# EAGLE schematic Schematic (EAGLE 9.1.3)
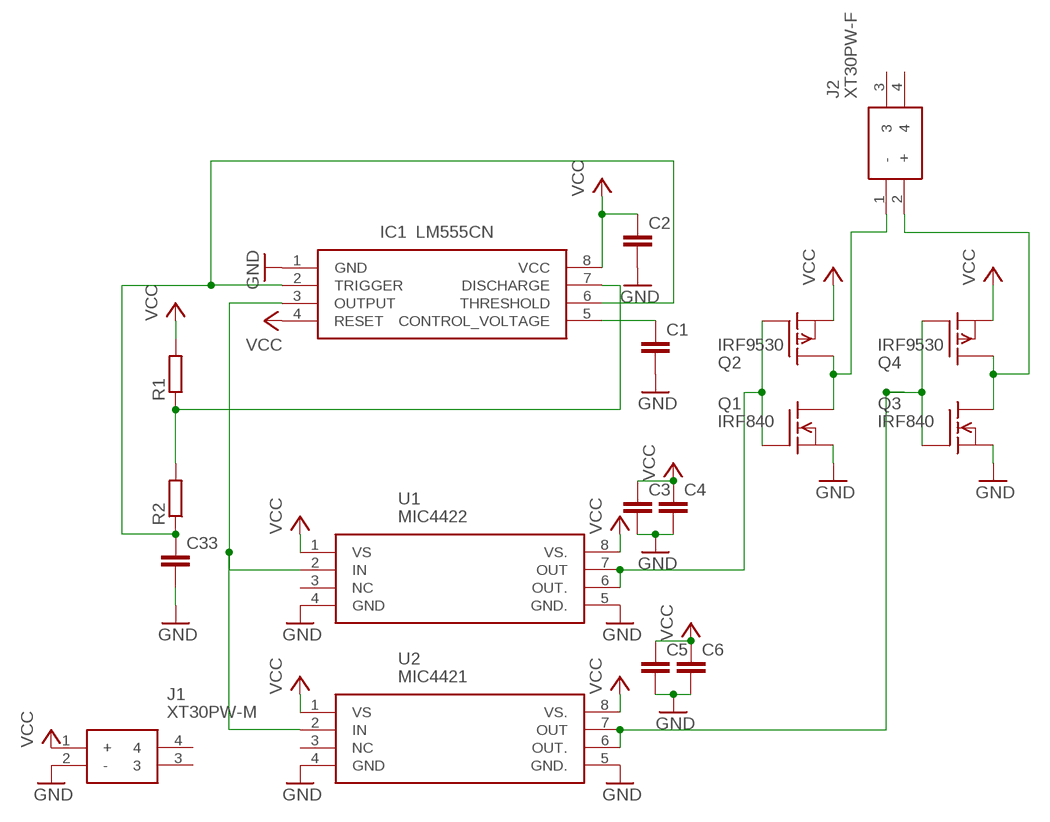
[diagram p0: schematic, sheet 1]

## Parts
C1  C-EU025-050X050  [C025-050X050]
C2  C-EUC0805  [C0805]
C3  C-EUC0805  [C0805]
C4  C-EUC0805  [C0805]
C5  C-EUC0805  [C0805]
C6  C-EUC0805  [C0805]
C33  C-EUC0805  [C0805]
IC1  LM555CN  [DIP762W53P254L980H533Q8N]
J1  XT30PW-M  [XT30PWM]
J2  XT30PW-F  [XT30PWF]
Q1  IRF840  [TO220]
Q2  IRF9530  [TO220]
Q3  IRF840  [TO220]
Q4  IRF9530  [TO220]
R1  R-EU_M0805  [M0805]
R2  R-EU_M0805  [M0805]
U1  MIC4422  MIC4421!  [MIC4421]
U2  MIC4421  MIC4421!  [MIC4421]

## Nets
GND: C1.2 C2.2 C3.2 C4.2 C5.2 C6.2 C33.2 IC1.1(GND) J1.2(-) Q1.3(S) Q3.3(S) U1.4(GND) U1.5(GND.) U2.4(GND) U2.5(GND.)
N$1: C33.1 IC1.2(TRIGGER) IC1.6(THRESHOLD) R2.1
N$2: IC1.7(DISCHARGE) R1.1 R2.2
N$3: C1.1 IC1.5(CONTROL_VOLTAGE)
N$4: J2.1(-) Q1.2(D) Q2.2(D)
N$5: J2.2(+) Q3.2(D) Q4.2(D)
N$8: IC1.3(OUTPUT) U1.2(IN) U2.2(IN)
N$9: Q1.1(G) Q2.1(G) U1.6(OUT.) U1.7(OUT)
N$10: Q3.1(G) Q4.1(G) U2.6(OUT.) U2.7(OUT)
VCC: C2.1 C3.1 C4.1 C5.1 C6.1 IC1.4(RESET) IC1.8(VCC) J1.1(+) Q2.3(S) Q4.3(S) R1.2 U1.1(VS) U1.8(VS.) U2.1(VS) U2.8(VS.)
Unconnected: J1.3 J1.4 J2.3 J2.4 U1.3(NC) U2.3(NC)

## Library data of the parts
C1-C6 C33 = rcl:C-EU: CAPACITOR, European symbol; SPICEPREFIX: C
IC1 = LM555CN:LM555CN: ON Semiconductor LM555CN, Timer, 4.5 16 V, 8-Pin PDIP Source: Datasheet <http://www.onsemi.com/pub/Collateral/LM555-D.pdf>; ARROW_PART_NUMBER: LM555CN; ARROW_PRICE-STOCK: https://www.arrow.com/en/products/lm555cn/on-semiconductor; DESCRIPTION: ON Semiconductor LM555CN, Timer, 4.5 16 V, 8-Pin PDIP; HEIGHT: 5.33mm; MANUFACTURER_NAME: ON Semiconductor; MANUFACTURER_PART_NUMBER: LM555CN; MOUSER_PART_NUMBER: 512-LM555CN; MOUSER_PRICE-STOCK: https://www.mouser.co.uk/ProductDetail/ON-Semiconductor-Fairchild/LM555CN?qs=AFLC8Sm4xaX0SxPz974UPA%3D%3D
J1 = XT30PW-M:XT30PW-M: 30A Low Temperature Rise Fire Retardant Plug Source: Datasheet <https://www.tme.eu/sl/Document/ce4077e36b79046da520ca73227e15de/XT30PW SPEC.pdf>; ARROW_PART_NUMBER: XT30PW-M; DESCRIPTION: 30A Low Temperature Rise Fire Retardant Plug; HEIGHT: 5mm; MANUFACTURER_NAME: Amass; MANUFACTURER_PART_NUMBER: XT30PW-M
J2 = XT30PW-F:XT30PW-F: Socket; DC supply; XT30; female; PIN:2; on PCBs; THT; Colour: yellow Source: Datasheet <https://www.tme.eu/Document/ce4077e36b79046da520ca73227e15de/XT30PW SPEC.pdf>; ARROW_PART_NUMBER: XT30PW-F; DESCRIPTION: Socket; DC supply; XT30; female; PIN:2; on PCBs; THT; Colour: yellow; HEIGHT: 5mm; MANUFACTURER_NAME: Amass; MANUFACTURER_PART_NUMBER: XT30PW-F
Q1 Q3 = transistor-fet:IRF840: N-Channel Enhancement MOSFET (HEXFET); 500V; 8A; 0,85Ohm
Q2 Q4 = transistor-fet:IRF9530: P-Channel Enhancement MOSFET (HEXFET); -100V; -12A; 0,3Ohm
R1 R2 = rcl:R-EU_: RESISTOR, European symbol; SPICEPREFIX: R
U1 U2 = MIC4421:MIC4421!